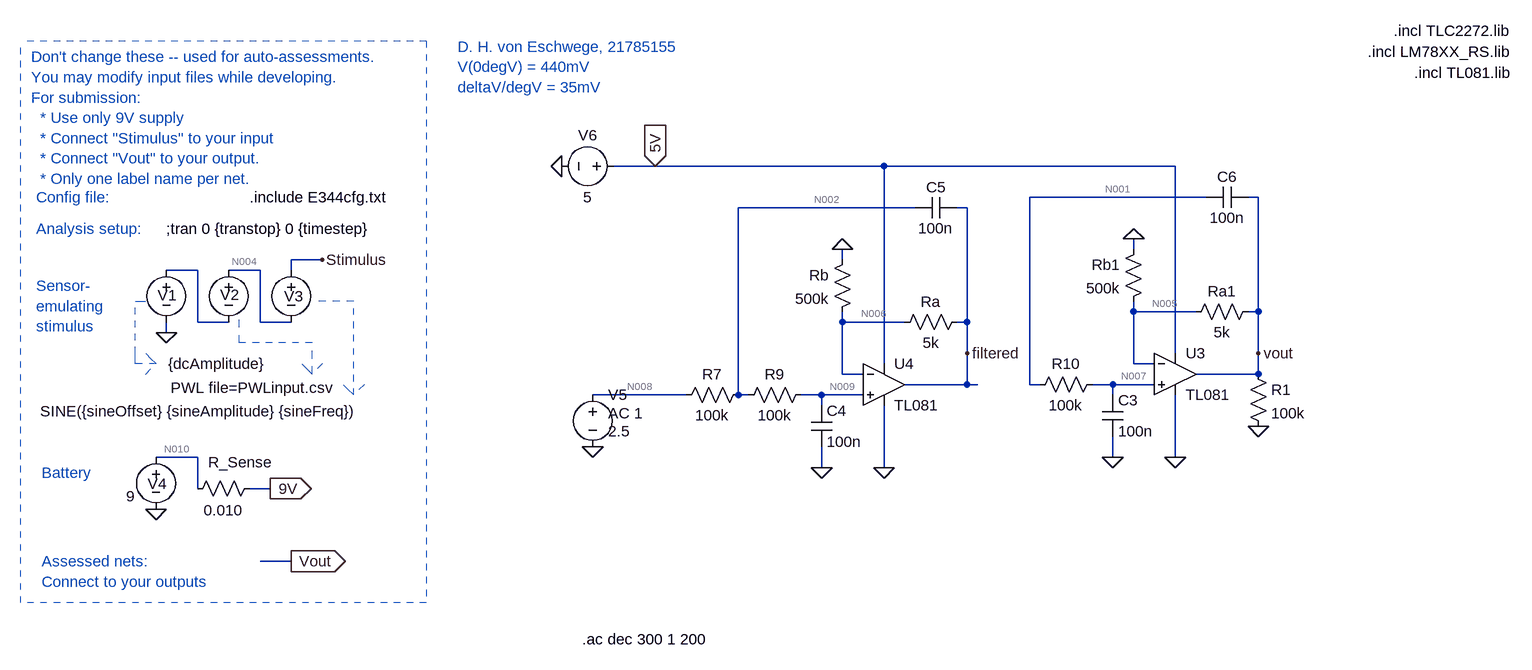
[diagram p0: schematic von_Eschwege_21785155_A1 - fc.asc]
von_Eschwege_21785155_A1 - fc.asc, the LTspice schematic file:
Version 4
SHEET 1 1824 680
WIRE -1328 -1216 -1392 -1216
WIRE -976 -1216 -1328 -1216
WIRE -528 -1216 -976 -1216
WIRE -480 -1168 -752 -1168
WIRE -400 -1168 -416 -1168
WIRE -928 -1152 -1200 -1152
WIRE -848 -1152 -864 -1152
WIRE -592 -1088 -592 -1104
WIRE -1840 -1072 -1888 -1072
WIRE -1040 -1072 -1040 -1088
WIRE -2032 -1056 -2080 -1056
WIRE -1936 -1056 -1984 -1056
WIRE -1888 -1056 -1888 -1072
WIRE -592 -992 -592 -1008
WIRE -496 -992 -592 -992
WIRE -400 -992 -400 -1168
WIRE -400 -992 -416 -992
WIRE -2032 -976 -2032 -1056
WIRE -1984 -976 -2032 -976
WIRE -1936 -976 -1936 -1056
WIRE -1888 -976 -1936 -976
WIRE -1040 -976 -1040 -992
WIRE -944 -976 -1040 -976
WIRE -848 -976 -848 -1152
WIRE -848 -976 -864 -976
WIRE -2080 -960 -2080 -976
WIRE -848 -928 -848 -976
WIRE -528 -928 -528 -1216
WIRE -400 -928 -400 -992
WIRE -976 -912 -976 -1216
WIRE -592 -912 -592 -992
WIRE -560 -912 -592 -912
WIRE -1040 -896 -1040 -976
WIRE -1008 -896 -1040 -896
WIRE -400 -896 -400 -928
WIRE -400 -896 -496 -896
WIRE -848 -880 -848 -928
WIRE -848 -880 -944 -880
WIRE -832 -880 -848 -880
WIRE -752 -880 -752 -1168
WIRE -736 -880 -752 -880
WIRE -624 -880 -656 -880
WIRE -560 -880 -624 -880
WIRE -1280 -864 -1424 -864
WIRE -1200 -864 -1200 -1152
WIRE -1184 -864 -1200 -864
WIRE -1072 -864 -1104 -864
WIRE -1008 -864 -1072 -864
WIRE -624 -864 -624 -880
WIRE -1072 -848 -1072 -864
WIRE -2032 -768 -2096 -768
WIRE -624 -768 -624 -800
WIRE -528 -768 -528 -864
WIRE -1072 -752 -1072 -784
WIRE -976 -752 -976 -848
WIRE -2032 -720 -2032 -768
WIRE -1920 -720 -1952 -720
WIRE -1888 -608 -1936 -608
FLAG -2080 -960 0
FLAG -1840 -1072 Stimulus
FLAG -1920 -720 9V
IOPIN -1920 -720 Out
FLAG -2096 -688 0
FLAG -1888 -608 Vout
IOPIN -1888 -608 Out
FLAG -976 -752 0
FLAG -1072 -752 0
FLAG -1040 -1088 0
FLAG -528 -768 0
FLAG -624 -768 0
FLAG -592 -1104 0
FLAG -1328 -1216 5V
IOPIN -1328 -1216 In
FLAG -1424 -784 0
FLAG -400 -816 0
FLAG -848 -928 filtered
FLAG -400 -928 vout
FLAG -1472 -1216 0
SYMBOL voltage -1984 -1072 R0
WINDOW 123 0 0 Left 0
WINDOW 39 0 0 Left 0
WINDOW 3 -89 197 Left 2
WINDOW 0 -13 54 Left 2
SYMATTR Value PWL file=PWLinput.csv
SYMATTR InstName V2
SYMBOL voltage -1888 -1072 R0
WINDOW 123 24 44 Left 2
WINDOW 39 0 0 Left 0
WINDOW 3 -386 233 Left 2
WINDOW 0 -11 56 Left 2
SYMATTR Value SINE({sineOffset} {sineAmplitude} {sineFreq})
SYMATTR InstName V3
SYMBOL voltage -2080 -1072 R0
WINDOW 123 0 0 Left 0
WINDOW 39 0 0 Left 0
WINDOW 3 3 160 Left 2
WINDOW 0 -13 55 Left 2
SYMATTR Value {dcAmplitude}
SYMATTR InstName V1
SYMBOL voltage -2096 -784 R0
WINDOW 123 24 44 Left 2
WINDOW 39 0 0 Left 0
WINDOW 3 -46 76 Left 2
WINDOW 0 -13 57 Left 2
SYMATTR Value 9
SYMATTR InstName V4
SYMBOL res -1936 -736 R90
WINDOW 0 -9 30 VBottom 2
WINDOW 3 34 56 VTop 2
SYMATTR InstName R_Sense
SYMATTR Value 0.010
SYMBOL res -1184 -880 R90
WINDOW 0 0 56 VBottom 2
WINDOW 3 32 56 VTop 2
SYMATTR InstName R7
SYMATTR Value 100k
SYMBOL cap -1088 -848 R0
SYMATTR InstName C4
SYMATTR Value 100n
SYMBOL Opamps\\opamp2 -976 -944 R0
SYMATTR InstName U4
SYMATTR Value TL081
SYMBOL res -1088 -880 R90
WINDOW 0 0 56 VBottom 2
WINDOW 3 32 56 VTop 2
SYMATTR InstName R9
SYMATTR Value 100k
SYMBOL res -848 -992 R90
WINDOW 0 0 56 VBottom 2
WINDOW 3 32 56 VTop 2
SYMATTR InstName Ra
SYMATTR Value 5k
SYMBOL res -1024 -1088 M0
SYMATTR InstName Rb
SYMATTR Value 500k
SYMBOL cap -864 -1168 R90
WINDOW 0 0 32 VBottom 2
WINDOW 3 32 32 VTop 2
SYMATTR InstName C5
SYMATTR Value 100n
SYMBOL cap -640 -864 R0
SYMATTR InstName C3
SYMATTR Value 100n
SYMBOL Opamps\\opamp2 -528 -960 R0
SYMATTR InstName U3
SYMATTR Value TL081
SYMBOL res -640 -896 R90
WINDOW 0 0 56 VBottom 2
WINDOW 3 32 56 VTop 2
SYMATTR InstName R10
SYMATTR Value 100k
SYMBOL res -400 -1008 R90
WINDOW 0 0 56 VBottom 2
WINDOW 3 32 56 VTop 2
SYMATTR InstName Ra1
SYMATTR Value 5k
SYMBOL res -576 -1104 M0
SYMATTR InstName Rb1
SYMATTR Value 500k
SYMBOL cap -416 -1184 R90
WINDOW 0 0 32 VBottom 2
WINDOW 3 32 32 VTop 2
SYMATTR InstName C6
SYMATTR Value 100n
SYMBOL voltage -1424 -880 R0
WINDOW 123 24 44 Left 2
WINDOW 39 0 0 Left 0
WINDOW 3 24 72 Left 2
SYMATTR Value2 AC 1
SYMATTR Value 2.5
SYMATTR InstName V5
SYMBOL res -416 -912 R0
SYMATTR InstName R1
SYMATTR Value 100k
SYMBOL voltage -1376 -1216 R90
WINDOW 0 -32 56 VBottom 2
WINDOW 3 32 56 VTop 2
WINDOW 123 0 0 Left 0
WINDOW 39 0 0 Left 0
SYMATTR InstName V6
SYMATTR Value 5
TEXT -2080 -1120 Left 2 !;tran 0 {transtop} 0 {timestep}
TEXT -1952 -1168 Left 2 !.include E344cfg.txt
TEXT -2288 -1384 Left 2 ;Don't change these -- used for auto-assessments.\nYou may modify input files while developing.\nFor submission: \n  * Use only 9V supply \n  * Connect "Stimulus" to your input\n  * Connect "Vout" to your output.\n  * Only one label name per net.
TEXT -2280 -1168 Left 2 ;Config file:
TEXT -2280 -1120 Left 2 ;Analysis setup:
TEXT -2272 -744 Left 2 ;Battery
TEXT -2280 -1032 Left 2 ;Sensor-\nemulating \nstimulus
TEXT -2272 -608 Left 2 ;Assessed nets:\nConnect to your outputs
TEXT -1632 -1400 Left 2 ;D. H. von Eschwege, 21785155\nV(0degV) = 440mV\ndeltaV/degV = 35mV
TEXT -192 -1424 Left 2 !.incl TLC2272.lib
TEXT -232 -1392 Left 2 !.incl LM78XX_RS.lib
TEXT -160 -1360 Left 2 !.incl TL081.lib
TEXT -1440 -488 Left 2 !.ac dec 300 1 200
LINE Normal -1792 -1008 -1856 -1008 2
LINE Normal -1792 -864 -1792 -1008 2
LINE Normal -1808 -880 -1792 -864 2
LINE Normal -1792 -864 -1808 -880 2
LINE Normal -1776 -880 -1792 -864 2
LINE Normal -2128 -1008 -2112 -1008 2
LINE Normal -2128 -928 -2128 -1008 2
LINE Normal -2128 -912 -2128 -928 2
LINE Normal -2096 -912 -2128 -912 2
LINE Normal -2112 -928 -2096 -912 2
LINE Normal -2096 -912 -2112 -928 2
LINE Normal -2112 -896 -2096 -912 2
LINE Normal -1968 -944 -1968 -992 2
LINE Normal -1856 -944 -1968 -944 2
LINE Normal -1856 -896 -1856 -944 2
LINE Normal -1872 -912 -1856 -896 2
LINE Normal -1856 -896 -1872 -912 2
LINE Normal -1840 -912 -1856 -896 2
LINE Normal -2304 -544 -2304 -1408 1
LINE Normal -1680 -1408 -1680 -544 1
LINE Normal -1680 -544 -2304 -544 1
LINE Normal -1680 -1408 -2304 -1408 1

The netlist it stands for:
* von_Eschwege_21785155_A1 - fc.asc
V2 N004 N003 PWL file=PWLinput.csv
V3 Stimulus N004 SINE({sineOffset} {sineAmplitude} {sineFreq})
V1 N003 0 {dcAmplitude}
V4 N010 0 9
R_Sense 9V N010 0.010
R7 N002 N008 100k
C4 N009 0 100n
XU4 N009 N006 5V 0 filtered TL081  ; pins In+ In- V+ V- OUT
R9 N009 N002 100k
Ra filtered N006 5k
Rb 0 N006 500k
C5 filtered N002 100n
C3 N007 0 100n
XU3 N007 N005 5V 0 Vout TL081  ; pins In+ In- V+ V- OUT
R10 N007 N001 100k
Ra1 Vout N005 5k
Rb1 0 N005 500k
C6 Vout N001 100n
V5 N008 0 2.5 AC 1
R1 Vout 0 100k
V6 5V 0 5
;tran 0 {transtop} 0 {timestep}
.include E344cfg.txt
* Don't change these -- used for auto-assessments.
* You may modify input files while developing.
* For submission:
*   * Use only 9V supply
*   * Connect "Stimulus" to your input
*   * Connect "Vout" to your output.
*   * Only one label name per net.
* Config file:
* Analysis setup:
* Battery
* Sensor-
* emulating
* stimulus
* Assessed nets:
* Connect to your outputs
* D. H. von Eschwege, 21785155
* V(0degV) = 440mV
* deltaV/degV = 35mV
.incl TLC2272.lib
.incl LM78XX_RS.lib
.incl TL081.lib
.ac dec 300 1 200
.backanno
.end

* Results of the author's LTspice run, read from the files saved beside the schematic
* Operating Point, zero values left out:
*   V(n004) = 1.63 V
*   V(stimulus) = 1.63 V
*   V(n010) = 9 V
*   V(9v) = 9 V
*   V(n002) = 2.5 V
*   V(n008) = 2.5 V
*   V(n009) = 2.5 V
*   V(filtered) = 2.525 V
*   V(5v) = 5 V
*   V(n006) = 2.5 V
*   V(n007) = 882.3 mV
*   V(vout) = 1.536 V
*   V(n005) = 1.521 V
*   V(n001) = 882.3 mV
*   I(R1) = 15.36 µA
*   I(Rb1) = -3.042 µA
*   I(Ra1) = 3.042 µA
*   I(Rb) = -5 µA
*   I(Ra) = 5 µA
*   I(R9) = -32.55 pA
*   I(R7) = -32.55 pA
*   I(V6) = -5.056 mA
*   I(V5) = -32.55 pA
*   Ix(u4:1) = 32.55 pA
*   Ix(u4:2) = 32.55 pA
*   Ix(u4:3) = 2.528 mA
*   Ix(u4:4) = -2.529 mA
*   Ix(u4:5) = -5 µA
*   Ix(u3:2) = 32 pA
*   Ix(u3:3) = 2.528 mA
*   Ix(u3:4) = -2.418 mA
*   Ix(u3:5) = -18.4 µA
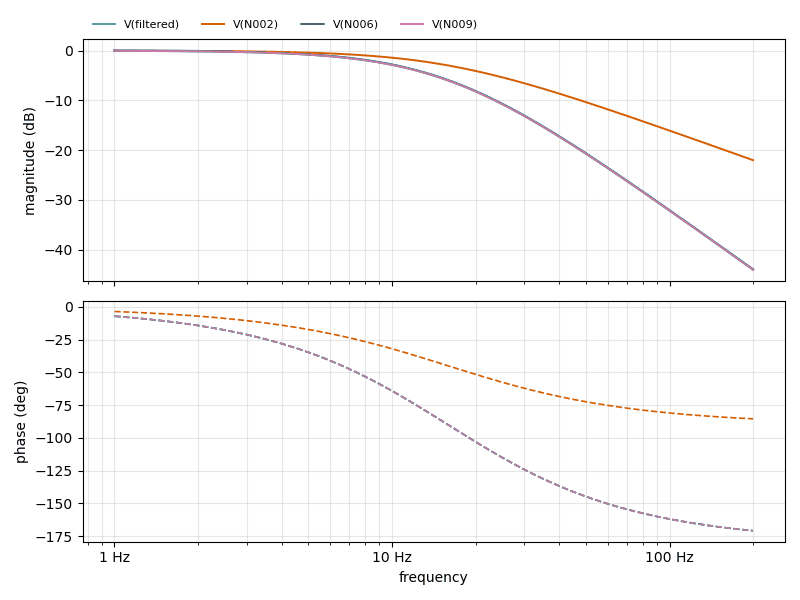
[diagram p1: AC Analysis of von_Eschwege_21785155_A1 - fc.asc, plotted from the saved traces]
* AC Analysis, 1 run:
*   V(filtered): 0.05 dB at 1 Hz, -43.94 dB at 200 Hz, peak 0.05 dB at 1 Hz, 3 dB below the peak at 10.38 Hz
*   V(N002): -0.02 dB at 1 Hz, -22.01 dB at 200 Hz, peak -0.02 dB at 1 Hz, 3 dB below the peak at 16.13 Hz
*   V(N006): -0.03 dB at 1 Hz, -44.02 dB at 200 Hz, peak -0.03 dB at 1 Hz, 3 dB below the peak at 10.38 Hz
*   V(N009): -0.03 dB at 1 Hz, -44.02 dB at 200 Hz, peak -0.03 dB at 1 Hz, 3 dB below the peak at 10.38 Hz